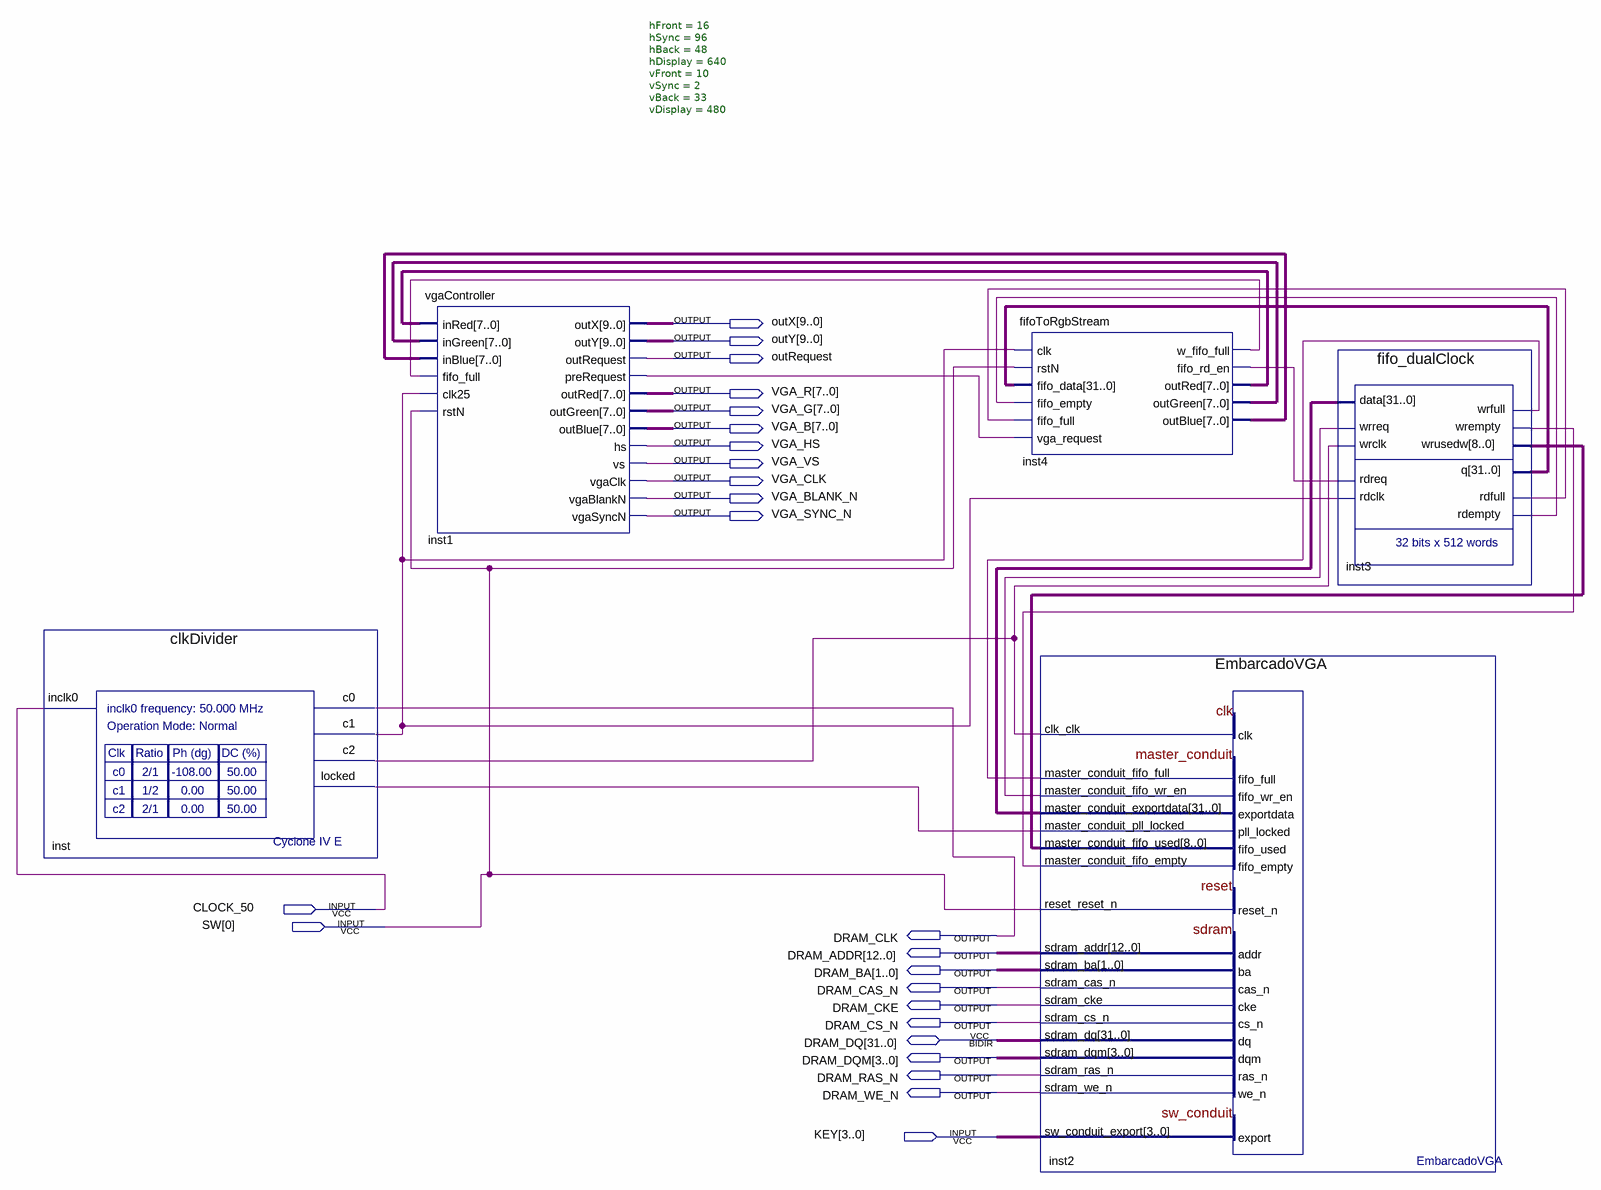
[diagram p0: schematic sheet]
// Quartus schematic ModuloVgaController.bdf as structural Verilog: 5 symbols, 24 pins
module ModuloVgaController (
  input  CLOCK_50,
  input  [0:0] SW,
  input  [3:0] KEY,
  inout  [31:0] DRAM_DQ,
  output [9:0] outX,
  output [9:0] outY,
  output outRequest,
  output [7:0] VGA_R,
  output [7:0] VGA_G,
  output [7:0] VGA_B,
  output VGA_HS,
  output VGA_VS,
  output VGA_CLK,
  output VGA_BLANK_N,
  output VGA_SYNC_N,
  output DRAM_CLK,
  output [12:0] DRAM_ADDR,
  output [1:0] DRAM_BA,
  output DRAM_CAS_N,
  output DRAM_CKE,
  output DRAM_CS_N,
  output [3:0] DRAM_DQM,
  output DRAM_RAS_N,
  output DRAM_WE_N
);

  wire inst1_prerequest, inst2_master_conduit_fifo_wr_en, inst3_rdempty, inst3_rdfull, inst3_wrempty,
       inst3_wrfull, inst4_fifo_rd_en, inst4_w_fifo_full, inst_c1, inst_c2, inst_locked;
  wire [7:0] inst4_outblue, inst4_outgreen, inst4_outred;
  wire [8:0] inst3_wrusedw;
  wire [31:0] inst2_master_conduit_exportdata, inst3_q;

  clkDivider inst (.inclk0(CLOCK_50), .c0(DRAM_CLK), .c1(inst_c1), .c2(inst_c2), .locked(inst_locked));
  vgaController #(.hFront(16), .hSync(96), .hBack(48), .hDisplay(640), .vFront(10), .vSync(2), .vBack(33), .vDisplay(480)) inst1 (
    .inRed(inst4_outred), .inGreen(inst4_outgreen), .inBlue(inst4_outblue), .fifo_full(inst4_w_fifo_full),
    .clk25(inst_c1), .rstN(SW[0]), .outX(outX), .outY(outY), .outRequest(outRequest),
    .preRequest(inst1_prerequest), .outRed(VGA_R), .outGreen(VGA_G), .outBlue(VGA_B), .hs(VGA_HS),
    .vs(VGA_VS), .vgaClk(VGA_CLK), .vgaBlankN(VGA_BLANK_N), .vgaSyncN(VGA_SYNC_N));
  fifoToRgbStream inst4 (
    .clk(inst_c1), .rstN(SW[0]), .fifo_data(inst3_q), .fifo_empty(inst3_rdempty), .fifo_full(inst3_rdfull),
    .vga_request(inst1_prerequest), .w_fifo_full(inst4_w_fifo_full), .fifo_rd_en(inst4_fifo_rd_en),
    .outRed(inst4_outred), .outGreen(inst4_outgreen), .outBlue(inst4_outblue));
  EmbarcadoVGA inst2 (
    .clk_clk(inst_c2), .master_conduit_fifo_full(inst3_wrfull), .master_conduit_pll_locked(inst_locked),
    .master_conduit_fifo_used(inst3_wrusedw), .master_conduit_fifo_empty(inst3_wrempty),
    .reset_reset_n(SW[0]), .sw_conduit_export(KEY),
    .master_conduit_fifo_wr_en(inst2_master_conduit_fifo_wr_en),
    .master_conduit_exportdata(inst2_master_conduit_exportdata), .sdram_addr(DRAM_ADDR), .sdram_ba(DRAM_BA),
    .sdram_cas_n(DRAM_CAS_N), .sdram_cke(DRAM_CKE), .sdram_cs_n(DRAM_CS_N), .sdram_dqm(DRAM_DQM),
    .sdram_ras_n(DRAM_RAS_N), .sdram_we_n(DRAM_WE_N), .sdram_dq(DRAM_DQ));
  fifo_dualClock inst3 (
    .data(inst2_master_conduit_exportdata), .wrreq(inst2_master_conduit_fifo_wr_en), .wrclk(inst_c2),
    .rdreq(inst4_fifo_rd_en), .rdclk(inst_c1), .wrfull(inst3_wrfull), .wrempty(inst3_wrempty),
    .wrusedw(inst3_wrusedw), .q(inst3_q), .rdfull(inst3_rdfull), .rdempty(inst3_rdempty));
endmodule
